# Altium schematic sheet 05_07_1bit_Full_Adder.SchDoc
size A4
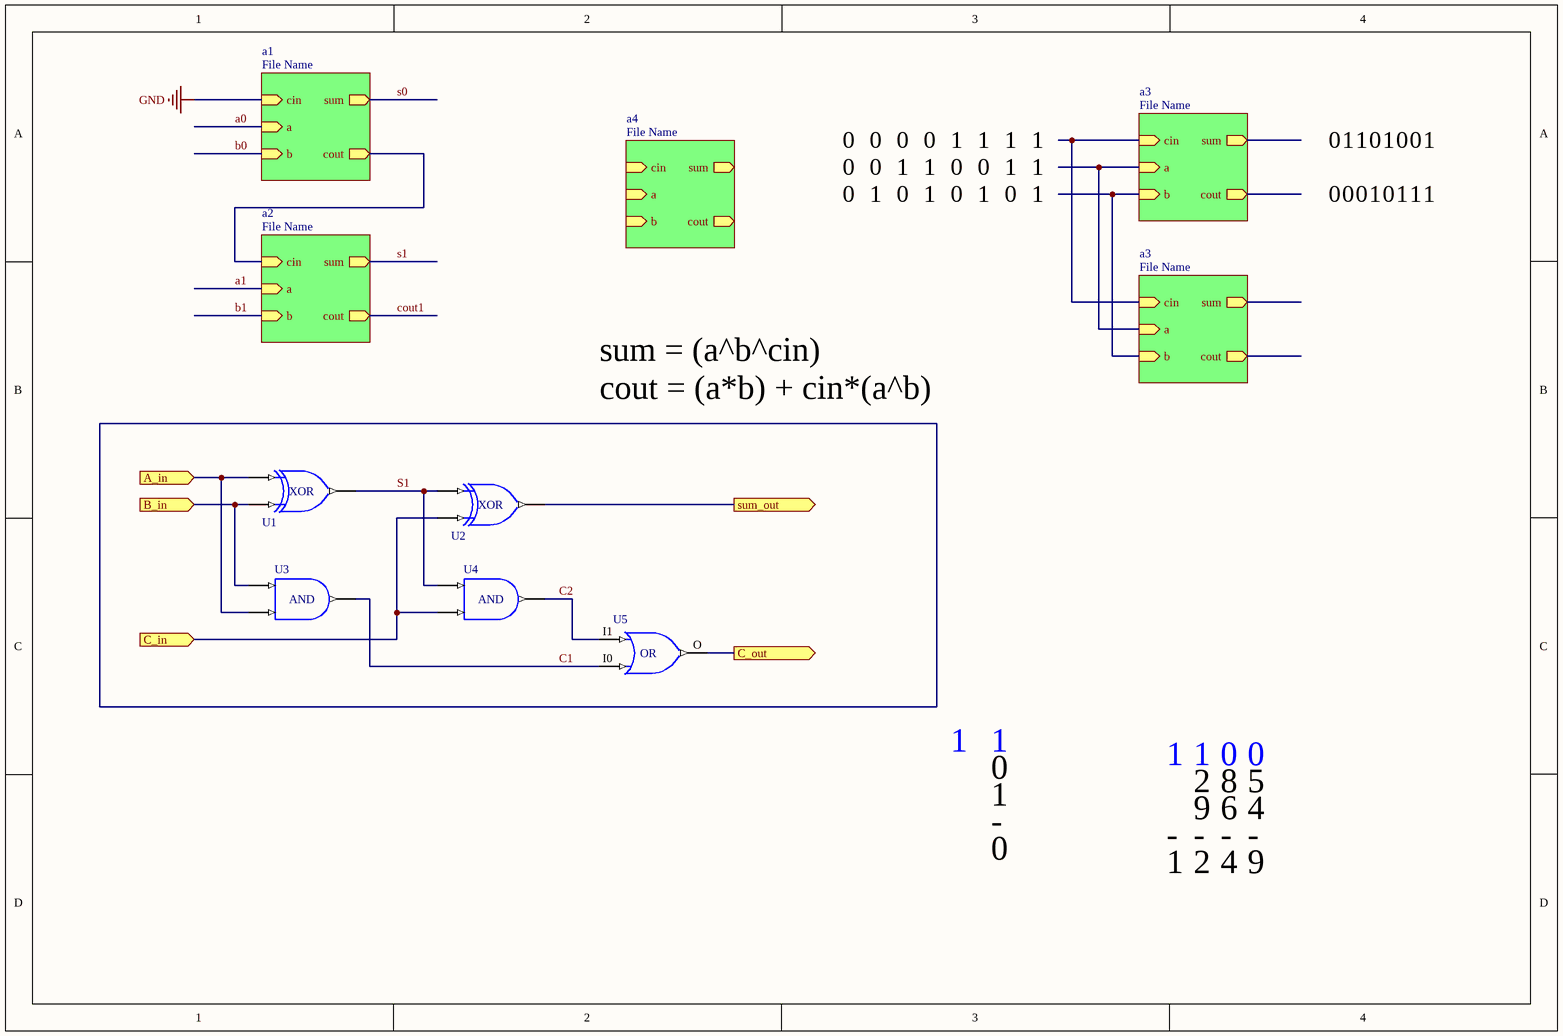
[diagram p0: 05_07_1bit_Full_Adder.SchDoc]

## Parts
U1  XOR
U2  XOR
U3  AND
U4  AND
U5  OR

## Sub-sheets
a1 = File Name: a (in), b (in), cin (in), sum (out), cout (out)
a2 = File Name: a (in), b (in), cin (in), sum (out), cout (out)
a3 = File Name: a (in), b (in), cin (in), sum (out), cout (out)
a3 = File Name: a (in), b (in), cin (in), sum (out), cout (out)
a4 = File Name: a (in), b (in), cin (in), sum (out), cout (out)

## Ports
A_in (in), B_in (in), C_in (in), C_out (out), sum_out (out)

## Nets
GND: U1.7(GND) U2.7(GND) ; sheet a1/cin
VDD: U1.14(VDD) U2.14(VDD)
a0: sheet a1/a
a1: sheet a2/a
A_in: U1.1(A) U3.B ; port A_in
b0: sheet a1/b
b1: sheet a2/b
B_in: U1.2(B) U3.A ; port B_in
C1: U3.Y U5.I0
C2: U4.Y U5.I1
C_in: U2.2(B) U4.B ; port C_in
C_out: U5.O ; port C_out
cout1: sheet a2/cout
s0: sheet a1/sum
S1: U1.3(Y) U2.1(A) U4.A ; sheet a2/sum
sum_out: U2.3(Y) ; port sum_out
(unnamed): sheet a1/cout, sheet a2/cin
(unnamed): sheet a3/a, sheet a3/a
(unnamed): sheet a3/b, sheet a3/b
(unnamed): sheet a3/cin, sheet a3/cin

## Notes on the sheet
- 0
- 1
- sum = (a^b^cin)
  cout = (a*b) + cin*(a^b)
- -
- 2
- 9
- 8
- 6
- 5
- 4

## Library data of the parts
U3 U4 = AND: 2 Input AND
U5 = OR2: 2-Input OR Gate; FPGAVendor: CUPL; Published: 17-Apr-2002; Publisher: Altium Limited